# Altium schematic sheet Input.SchDoc
size A
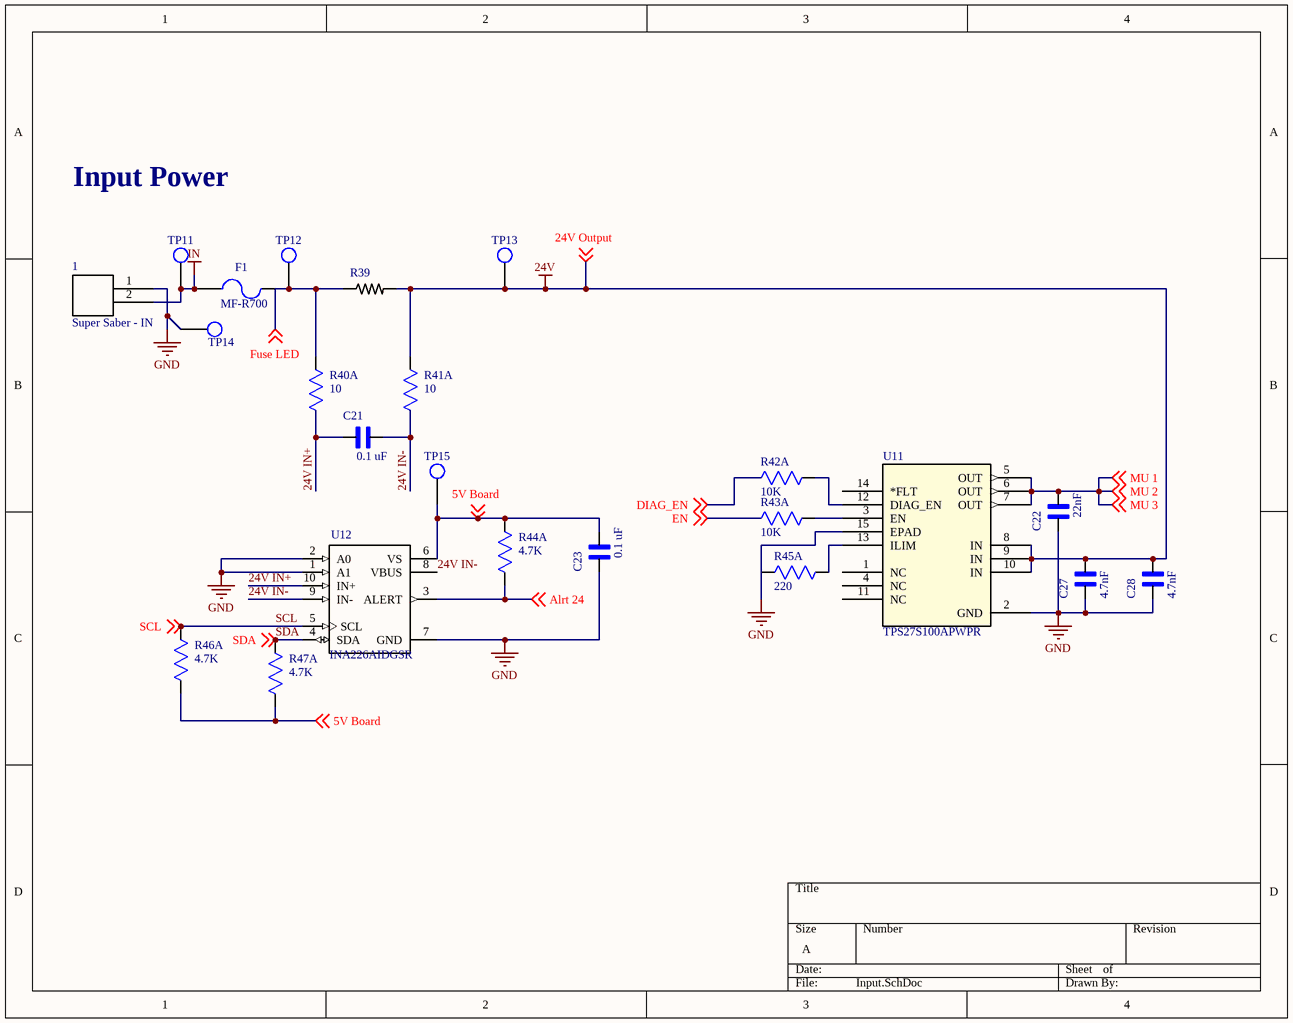
[diagram p0: Input.SchDoc]

## Parts
1  Super Saber - IN  [0431600102]
C21  0.1 uF  [*CAPC2012X135N]
C22  22nF  [*CAPC2012X135N]
C23  0.1 uF  [*CAPC2012X135N]
C27  4.7nF  [*CAPC2012X135N]
C28  4.7nF  [*CAPC2012X135N]
F1  MF-R700  [*2920_FUSE]
R39  1-1879378-2  [*RESC6331X70N]  (value not drawn)
R40  10  [RC0805N]  (part A of 2)
R41  10  [RC0805N]  (part A of 2)
R42  10K  [RC0805N]  (part A of 2)
R43  10K  [RC0805N]  (part A of 2)
R44  4.7K  [RC0805N]  (part A of 2)
R45  220  [RC0805N]  (part A of 2)
R46  4.7K  [RC0805N]  (part A of 2)
R47  4.7K  [RC0805N]  (part A of 2)
TP11  Test Point  [Test Point Through-hole]  (value not drawn)
TP12  Test Point  [Test Point Through-hole]  (value not drawn)
TP13  Test Point  [Test Point Through-hole]  (value not drawn)
TP14  Test Point  [Test Point Through-hole]  (value not drawn)
TP15  Test Point  [Test Point Through-hole]  (value not drawn)
U11  TPS27S100APWPR  [PWP14-M]
U12  INA226AIDGSR  [*SOP50P490X110-10N]

## Nets
24V: C27.2 C28.2 R39.2 R41.1 TP13.1 U11.8(IN) U11.9(IN) U11.10(IN) ; off-sheet 24V Output   [also labelled 24V Output ]
GND: 1.1 C22.1 C23.1 C27.1 C28.1 TP14.1 U11.2(GND) U11.15(EPAD) U12.1(A1) U12.2(A0) U12.7(GND)
IN: 1.2 F1.1 TP11.1
5V Board : C23.2 R44.1 TP15.1 U12.6(VS) ; off-sheet 5V Board 
24V IN+: C21.1 R40.2 U12.10(IN+)
24V IN-: C21.2 R41.2 U12.8(VBUS) U12.9(IN-)
Alrt 24: U12.3(ALERT) ; off-sheet Alrt 24
DIAG_EN: R42.2 ; off-sheet DIAG_EN
EN: R43.2 ; off-sheet EN
Fuse LED: F1.2 R39.1 R40.1 TP12.1 ; off-sheet Fuse LED
MU 1: C22.2 U11.5(OUT) U11.6(OUT) U11.7(OUT) ; off-sheet MU 1, off-sheet MU 2, off-sheet MU 3   [also labelled MU 2, MU 3 ]
SCL: R46.1 U12.5(SCL) ; off-sheet SCL
SDA: R47.1 U12.4(SDA) ; off-sheet SDA
NetR42_1: R42.1 U11.12(DIAG_EN)
NetR43_1: R43.1 U11.3(EN)
NetR45_1: R45.1 U11.13(ILIM)

Not connected (* = marked no-connect by the designer): R44 2; R45 2; R46 2; R47 2; U11 1(NC) 4(NC) 11(NC) 14(*FLT)

## Notes on the sheet
- Input Power

## Library data of the parts
1 = Super Saber
C21-C23 C27 C28 = EMK212BJ225KG-T: / Cap Ceramic 2.2uF 16V X5R 10% SMD 0805 125Â°C Embossed T/R /; MF: Taiyo Yuden; MP: EMK212BJ225KG-T; Package: 2012 Taiyo Yuden; Digi-Key_Purchase_URL: https://www.digikey.com/product-detail/en/taiyo-yuden/EMK212BJ225KG-T/587-1293-1-ND/931070?utm_source=snapeda&utm_medium=aggregator&utm_campaign=symbol; Digi-Key_Part_Number: 587-1293-1-ND; SnapEDA_Link: https://www.snapeda.com/parts/EMK212BJ225KG-T/Taiyo%20Yuden/view-part/?ref=snap; Value: *
F1 = Fuse 2: Fuse; Published: 8-Jun-2000; LatestRevisionDate: 17-Jul-2002; LatestRevisionNote: Re-released for DXP Platform.; PackageReference: PIN-W2/E2.8; Publisher: Altium Limited; PackageDescription: Thru-Hole; 2 Leads
R39 = TLR3A20KR003FTDG: TLR 2512 2.0W R003 1% 150PPM 2K RL; Power_Rating: 2 W; MF: TE Connectivity; Resistance: .003; MP: TLR3A20KR003FTDG; Digi-Key_Purchase_URL: https://www.digikey.com/product-detail/en/te-connectivity-passive-product/TLR3A20KR003FTDG/A131783CT-ND/8603913?utm_source=snapeda&utm_medium=aggregator&utm_campaign=symbol; SnapEDA_Link: https://www.snapeda.com/parts/TLR3A20KR003FTDG/TE%20Connectivity/view-part/1169417/?ref=snap; TE_purchase_URL: https://www.te.com/usa-en/product-1-1879378-2.html?te_bu=Cor&te_type=disp&te_campaign=seda_glo_cor-seda-global-disp-prtnr-fy19-seda-model-bom-cta_sma-317_1&elqCampaignId=32493; Package: 2512; Digi-Key_Part_Number: A131783CT-ND; EU_RoHS_Compliance: Compliant; Tolerance: 1%; Value: *
R40-R47 = CRCW0805681RFKEA: No Description Available; Manufacturer_Part_Number: CRCW0805681RFKEA_1; Vendor: Vishay; Built_By: EMA_UL_Team; Copyright: Copyright (C) 2018 Accelerated Designs. All rights reserved; RefDes: RefDes; Type: DEV; Value: Value
U11 = TPS27S100APWPR: No Description Available; Built_By: EMA_Molly; Vendor: Texas Instruments; Copyright: Copyright (C) 2018 Accelerated Designs. All rights reserved; Manufacturer_Part_Number: TPS27S100APWPR; RefDes: RefDes; Type: DEV; Value: Value
U12 = INA226AIDGSR: Current Monitor Regulator High/Low-Side 10mA 10-VSSOP; MF: Texas Instruments; Digi-Key_Part_Number: 296-29034-1-ND; SnapEDA_Link: https://www.snapeda.com/parts/INA226AIDGSR/Texas%20Instruments/view-part/53552/?ref=snap; Package: MSOP-10 Texas Instruments; MP: INA226AIDGSR; Digi-Key_Purchase_URL: https://www.digikey.com/product-detail/en/texas-instruments/INA226AIDGSR/296-29034-1-ND/2687118?utm_source=snapeda&utm_medium=aggregator&utm_campaign=symbol; Value: *